# Altium schematic sheet Driving_Circuit_one.SchDoc
size A4; SheetNumber: 1; SheetTotal: 2
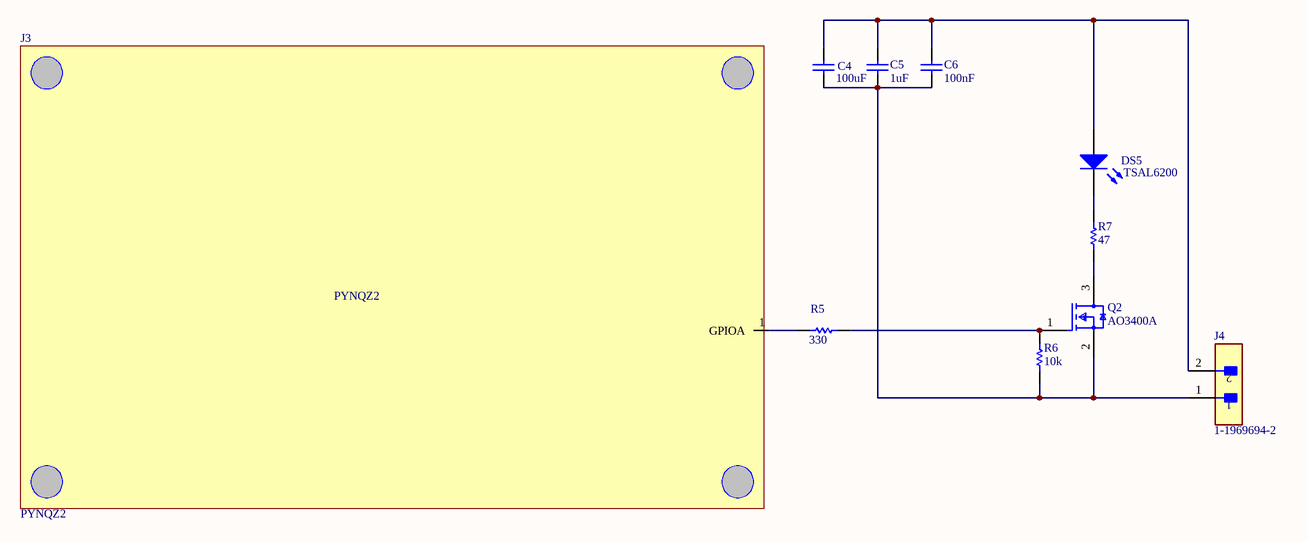
[diagram p0: Driving_Circuit_one.SchDoc]

## Parts
C4  100uF  [CAPC2013X145X48ML20T23]
C5  1uF  [CAPC2013X145X48ML20T23]
C6  100nF  [CAPC2013X145X48ML20T23]
DS5  TSAL6200  [VISH-TSAL6200]
J3  PYNQZ2  [PYNQZ2_board]
J4  1-1969694-2  [FP-1-1969694-2-MFG]
Q2  AO3400A  [FP-SOT23-MFG]
R5  330  [RESC3116X65X40LL10T20]
R6  10k  [RESC3116X65X40LL10T20]
R7  47  [RESC3116X65X40LL10T20]

## Nets
NetC4_1: C4.1 C5.1 C6.1 J4.1 Q2.2(S) R6.1
NetC4_2: C4.2 C5.2 C6.2 DS5.1(A) J4.2
NetDS5_2: DS5.2(K) R7.2
NetJ3_1: J3.1(GPIOA) R5.2
NetQ2_1: Q2.1(G) R5.1 R6.2
NetQ2_3: Q2.3(D) R7.1

## Library data of the parts
C4-C6 = CMP-2007-03205-1: Manufacturer: Vitramon; Part Number: VJ0805Y682KXAMT
DS5 = CMP-2000-07327-1: High Power Infrared Emitting Diode, GaAlAs, MQW, 1.35 V, 100 mA, -40 to 85 degC, 2-Pin THD, RoHS, Bulk; Manufacturer: Vishay; Lum Intensity: 500mW/srmcd; Product Depth (mm): 5.8mm; Type: IrLED; Luminous Intensity: 500mW/sr; Forward Voltage: 3V; Shape Type: Circular; Peak Wavelength: 950nm; Rad Hardened: No; Product Height (mm): 8.7mm; Number of  Elements: 1; Forward Current: 100mA; High Brightness: Yes; Reverse Voltage: 5V; DELETED: Compliant; Power Dissipation: 160W; Viewing Angle: 34deg; Lens Type: Colored; Packaging: Bulk; Lens Dimensions: 5x5x7.7mm; Package Reference: TSAL6200; Chip Material: GaAlAs; Package Description: 2-Pin Through Hole Device, Dia 5.8 mm, Pitch 2.54 mm; Main Category: IrLED; Manufacturer URL: http://www.vishay.com/; Product Length (mm): 5.8mm; Datasheet URL: http://www.vishay.com/docs/81010/tsal6200.pdf; Operating Temperature Classification: Industrial; Package Type: T-13/4; Pin Count: 2; Mounting: ThroughHole; Mounting Technology: ThroughHole; Test Current (It): 100mA; Datasheet Version: Rev. 2.4, 03/2014; Operating Temp Range: -40Cto85C
J4 = CMP-03373-000004-1: CONN HEADER R/A 2POS 6MM; Connector Type: Tab; Connector System: Wire-to-Board; Contact Retention: Yes (With); Contact Current Rating: 19.5A; Number of Positions: 2; Approvals: VDE; PCB Mounting Orientation: Right Angle; Sealable: No (Without); Circuit Application: Power; VDE Tested: Yes; Contact Material: Copper Alloy; Number of Rows: 1; Min Operating Temperature: -55°C; Flammability Rating: UL94 V-0; Housing Color: Grey; Termination: Through Hole; Packaging: Carton; Housing Material: Nylon; Contact Plating: Tin; Max Operating Temperature: 150°C; PCB Mount Alignment: Yes (With); Pitch: 6mm; Number of Power Positions: 2; Mating Retention: Yes (With)
Q2 = CMP-83955-000006-1: MOSFET N-CH 30V 5.7A SOT23; Input Capacitance: 630pF; Number of Elements: 1; Rds On Max: 26.5mR; Max Power Dissipation: 1.4W; Gate to Source Voltage (Vgs): 12V; Min Operating Temperature: -55°C; Lead Free: Lead Free; Number of Pins: 3; Drain to Source Voltage (Vdss): 30V; Case/Package: SOT-23; Mount: Surface Mount; Continuous Drain Current (ID): 5.7A; Radiation Hardening: No; Packaging: Tape and Reel; Max Operating Temperature: 150°C; Power Dissipation: 1.4W
R5-R7 = CMP-2003-04964-1: Part Number: RC1206FR-10750RL; Manufacturer: Yageo